# Altium schematic sheet Controller.SchDoc
size A; SheetNumber: 4; SheetTotal: 6
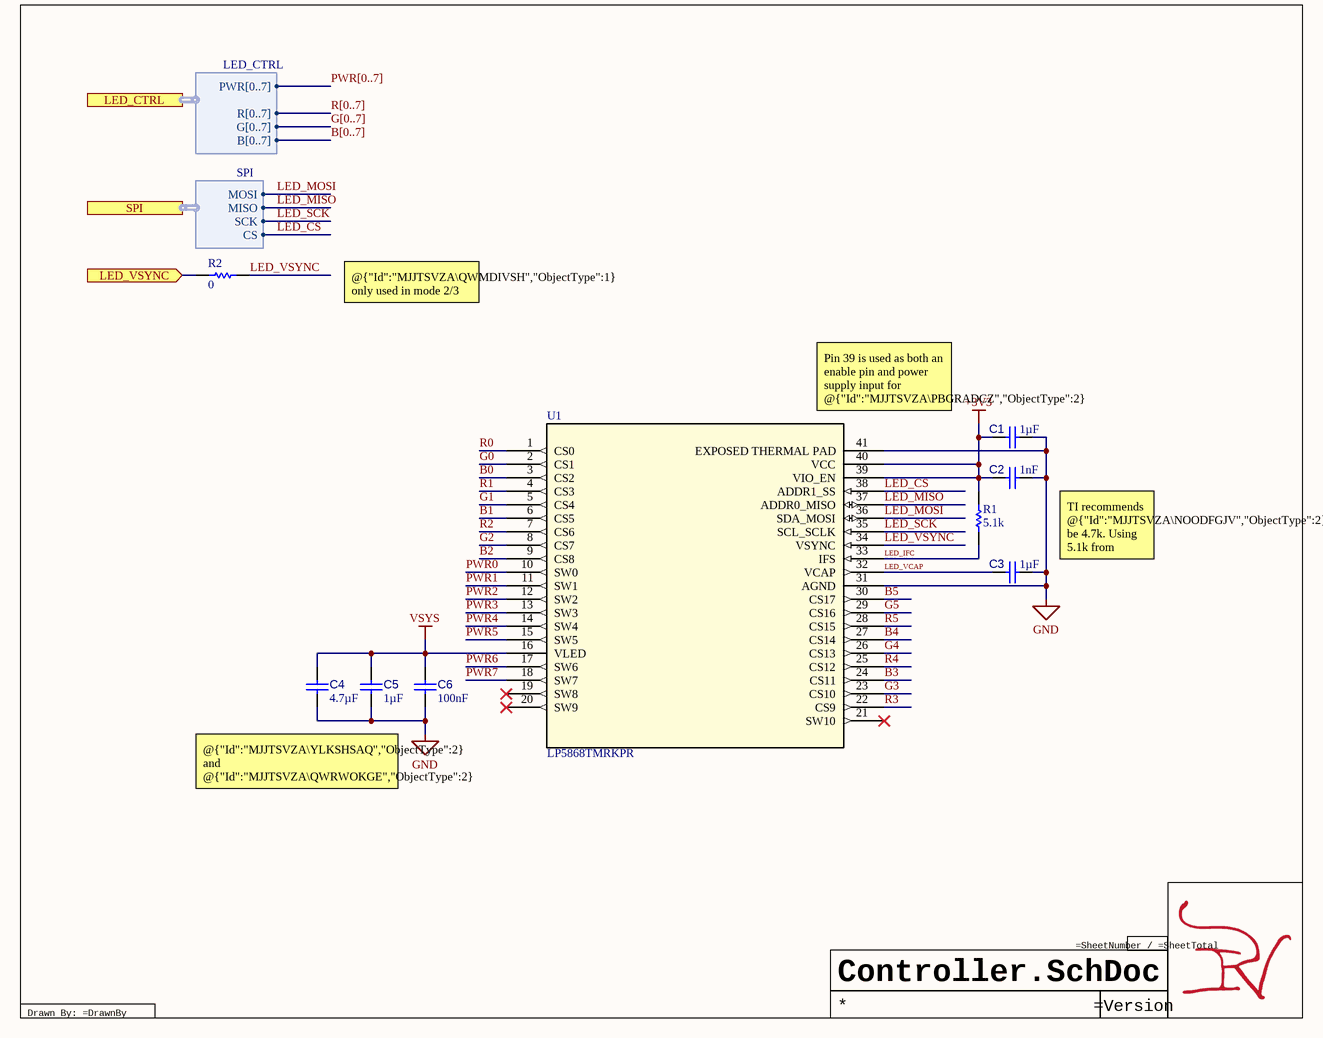
[diagram p0: Controller.SchDoc]

## Parts
C1  value 1µF  [CAP 0201_0603]  (hidden comment: GRM033R60J105MEA2D)
C2  value 1nF  [CAP 0402_1005]  (hidden comment: GRM1555C1H102JA01D)
C3  value 1µF  [CAP 0201_0603]  (hidden comment: GRM033R60J105MEA2D)
C4  value 4.7µF  [CAP 0402_1005]  (hidden comment: CL05A475MP5NRNC)
C5  value 1µF  [CAP 0201_0603]  (hidden comment: GRM033R60J105MEA2D)
C6  value 100nF  [CAP 0201_0603]  (hidden comment: CL03A104KQ3NNNC)
R1  value 5.1k  [RES 0201_0603]  (hidden comment: 5k1-0201-0.05/1)
R2  value 0  [RES 0402_1005]  (hidden comment: 0-0402-0.1)
U1  LP5868TMRKPR  [VQFN40-RKP_TEX]

## Ports
LED_CTRL (harness LED_CTRL, see LEDMatrix[2B], Matrix[1A]), LED_VSYNC (in, see LEDMatrix[2B]), SPI (harness SPI, see LEDMatrix[2B])

## Harnesses
LED_CTRL: PWR[0..7], R[0..7], B[0..7], G[0..7]
SPI: MOSI, MISO, SCK, CS

## Nets
+3V3: C1.2 C2.2 R1.2 U1.39(VIO_EN) U1.40(VCC)
GND: C1.1 C2.1 C3.2 C4.2 C5.1 C6.1 U1.31(AGND) U1.41(EXPOSED_THERMAL_PAD)
VSYS: C4.1 C5.2 C6.2 U1.16(VLED)
B0: U1.3(CS2)
B1: U1.6(CS5)
B2: U1.9(CS8)
B3: U1.24(CS11)
B4: U1.27(CS14)
B5: U1.30(CS17)
G0: U1.2(CS1)
G1: U1.5(CS4)
G2: U1.8(CS7)
G3: U1.23(CS10)
G4: U1.26(CS13)
G5: U1.29(CS16)
LED_CS: U1.38(ADDR1_SS) ; port SPI.CS
LED_IFC: R1.1 U1.33(IFS)
LED_MISO: U1.37(ADDR0_MISO) ; port SPI.MISO
LED_MOSI: U1.36(SDA_MOSI) ; port SPI.MOSI
LED_SCK: U1.35(SCL_SCLK) ; port SPI.SCK
LED_VCAP: C3.1 U1.32(VCAP)
LED_VSYNC: R2.2 U1.34(VSYNC)
LED_VSYNC: R2.1 ; port LED_VSYNC  [a separate net that carries the same name]
PWR0: U1.10(SW0)
PWR1: U1.11(SW1)
PWR2: U1.12(SW2)
PWR3: U1.13(SW3)
PWR4: U1.14(SW4)
PWR5: U1.15(SW5)
PWR6: U1.17(SW6)
PWR7: U1.18(SW7)
R0: U1.1(CS0)
R1: U1.4(CS3)
R2: U1.7(CS6)
R3: U1.22(CS9)
R4: U1.25(CS12)
R5: U1.28(CS15)

Not connected (* = marked no-connect by the designer): U1 19(SW8)* 20(SW9)* 21(SW10)*

## Buses and harness runs
bus B[0..7]
bus G[0..7]
bus PWR[0..7]
bus R[0..7]

## Notes on the sheet
- @{"Id":"MJJTSVZA\QWMDIVSH","ObjectType":1} only used in mode 2/3
- Pin 39 is used as both an enable pin and power supply input for @{"Id":"MJJTSVZA\PBGRADCZ","ObjectType":2} digital circuits
- TI recommends @{"Id":"MJJTSVZA\NOODFGJV","ObjectType":2} be 4.7k. Using 5.1k from @{"Id":"WRNONFHP\BOMUHTAU","ObjectType":2}
- @{"Id":"MJJTSVZA\YLKSHSAQ","ObjectType":2} and @{"Id":"MJJTSVZA\QWRWOKGE","ObjectType":2} were not in typical circuit, but have been added to help with power input from USB
- Drawn By: =DrawnBy

## Library data of the parts
C1 C3 C5 = CMP-001-00030-2: Ceramic Capacitor, Multilayer, Ceramic, 6.3V, 20% +Tol, 20% -Tol, X5R, 15% TC, 1uF, Surface Mount, 0201; Multilayer: Yes; Reach SVHC Compliant: Yes; Min Operating Temperature: -55°C; Mounting Technology: Surface Mount; Temperature Characteristics Code: X5R; Tolerance (fill in as +-): 20%; Capacitor Type: Ceramic; Pins: 2; Tolerance  (fill in as +-): 20%; RoHS Compliant: Yes; JESD-609 Code: e3; Package Shape: Rectangular; Dielectric Material: Ceramic; Max Operating Temperature: 85°C; Packaging: Tape and Reel; Terminal Finish: Nickel; Rated DC Voltage (URdc): 6.3V; Case/Package: 0201; Termination: Wraparound
C2 = CMP-001-00027-1: Ceramic Capacitor, Multilayer, Ceramic, 50V, 5% +Tol, 5% -Tol, C0G, 30ppm/Cel TC, 0.001uF, Surface Mount, 0402; Multilayer: Yes; Case/Package: 0402; Tolerance  (fill in as +-): 5%; Capacitor Type: Ceramic; Height: 0.5mm; Rated DC Voltage (URdc): 50V; Terminal Finish: Nickel; Tolerance (fill in as +-): 5%; RoHS Compliant: Yes; Package Shape: Rectangular; Length: 1mm; Package Style: SMTMeter; Packaging: Tape and Reel; Max Operating Temperature: 125°C; Temperature Characteristics Code: C0G; Pins: 2; Mounting Technology: Surface Mount; Termination: Wraparound; JESD-609 Code: e3; Width: 0.5mm; Min Operating Temperature: -55°C; Dielectric Material: Ceramic; Reach SVHC Compliant: Yes
C4 = CMP-001-00020-1: Ceramic Capacitor, Multilayer, Ceramic, 10V, 20% +Tol, 20% -Tol, X5R, 15% TC, 4.7uF, Surface Mount, 0402; Multilayer: Yes; Terminal Finish: Nickel; JESD-609 Code: e3; Tolerance (fill in as +-): 20%; Case/Package: 0402; Max Operating Temperature: 85°C; Tolerance  (fill in as +-): 20%; Temperature Characteristics Code: X5R; Packaging: Tape and Reel; Mounting Technology: Surface Mount; Width: 0.5mm; Pins: 2; Min Operating Temperature: -55°C; Package Style: SMTMeter; Capacitor Type: Ceramic; RoHS Compliant: Yes; Height: 0.65mm; Rated DC Voltage (URdc): 10V; Termination: Wraparound; Dielectric Material: Ceramic; Reach SVHC Compliant: Yes; Package Shape: Rectangular; Length: 1mm
C6 = CMP-001-00029-1: Ceramic Capacitor, Multilayer, Ceramic, 6.3V, 10% +Tol, 10% -Tol, X5R, 15% TC, 0.1uF, Surface Mount, 0201; Multilayer: Yes; Temperature Characteristics Code: X5R; Capacitor Type: Ceramic; Min Operating Temperature: -55°C; Reach SVHC Compliant: Yes; Termination: Wraparound; Mounting Technology: Surface Mount; Terminal Finish: Nickel; Pins: 2; JESD-609 Code: e3; Rated DC Voltage (URdc): 6.3V; Case/Package: 0201; Packaging: Tape and Reel; Tolerance  (fill in as +-): 10%; Height: 0.3mm; Length: 0.6mm; Package Shape: Rectangular; Max Operating Temperature: 85°C; Package Style: SMTMeter; Tolerance (fill in as +-): 10%; RoHS Compliant: Yes; Dielectric Material: Ceramic; Width: 0.3mm
R1 = CMP-009-00053-1: Fixed Resistor, Metal Glaze/thick Film, 0.05W, 5100ohm, 25V, 1% +/-Tol, 200ppm/Cel, Surface Mount, 0201; Power: 50mW; Reference Standard: AEC-Q200; Temperature Coefficient: 200ppm/°C; Package Width: 0.3mm; Rated Temperature: 70°C; Package Height: 0.23mm; Package Length: 0.6mm; Min Operating Temperature: -55°C; Max Operating Temperature: 125°C; Tolerance: 1%; Pins: 2; Case/Package: 0201; Construction: Rectangular; Packaging: Tape and Reel; JESD-609 Code: e3; Terminal Finish: Nickel; Termination: Wraparound; Package Style: SMTMeter; Working Voltage: 25V; Package Shape: Rectangular; Resistor Type: FIXED RESISTOR; RoHS Compliant: Yes; Reach SVHC Compliant: Yes; Mounting Technology: Surface Mount; Technology: METAL GLAZE/THICK FILM
R2 = CMP-009-00062-1: Fixed Resistor, Metal Glaze/thick Film, 0.1W, 0ohm, Surface Mount, 0402; Package Width: 0.5mm; Power: 100mW; Tolerance: 1%; Rated Temperature: 70°C; Package Length: 1mm; Reference Standard: AEC-Q200; Package Height: 0.35mm; Temperature Coefficient: 100ppm/°C; Working Voltage: 50V; Min Operating Temperature: -55°C; Package Style: SMTMeter; Reach SVHC Compliant: Yes; Technology: METAL GLAZE/THICK FILM; Resistor Type: FIXED RESISTOR; JESD-609 Code: e3; Construction: Rectangular; Package Shape: Rectangular; RoHS Compliant: Yes; Pins: 2; Terminal Finish: Nickel; Case/Package: 0402; Max Operating Temperature: 155°C; Packaging: Tape and Reel; Termination: Wraparound; Mounting Technology: Surface Mount
U1 = CMP-776-000000-2: 8 x 18 high-current LED matrix driver with 8-bit analog and 8-/16-bit PWM dimming; Mfr_Name: Texas Instruments; RefDes: RefDes; Source: LP5868TMRKPR.SchLib; Type: Power Management; Design Item ID: LP5868TMRKPR